# Altium schematic sheet Sch_Sensores.SchDoc: Control de Domótica
size A4; Author: Francisco González González - Eugenia Ipar; CompanyName: Control de Sensores; DocumentNumber: 5; SheetNumber: 5; SheetTotal: 12; Materia: Técnicas Digitales II; Year: 2015; Placa: Sensores; Prof1: Prof: Alarcón, Juan; Prof2: Ayud: Crivelli, Marcelo; Prof3: Ayud: Montalti, Pablo; PageSetup: Record=PageOptions|CenterHorizontal=True|CenterVertical=True|PrintScale=1.00|XCorrection=1.00|YCorrection=1.00|PrintKind=0|BorderSize=5000000|LeftOffset=0|BottomOffset=0|Orientation=2|PaperLength=1000|PaperWidth=1000|Scale=100|PaperSource=7|PrintQuality=-3|MediaType=1|DitherType=10|PrintScaleMode=1|PaperKind=A4|PaperIndex=9
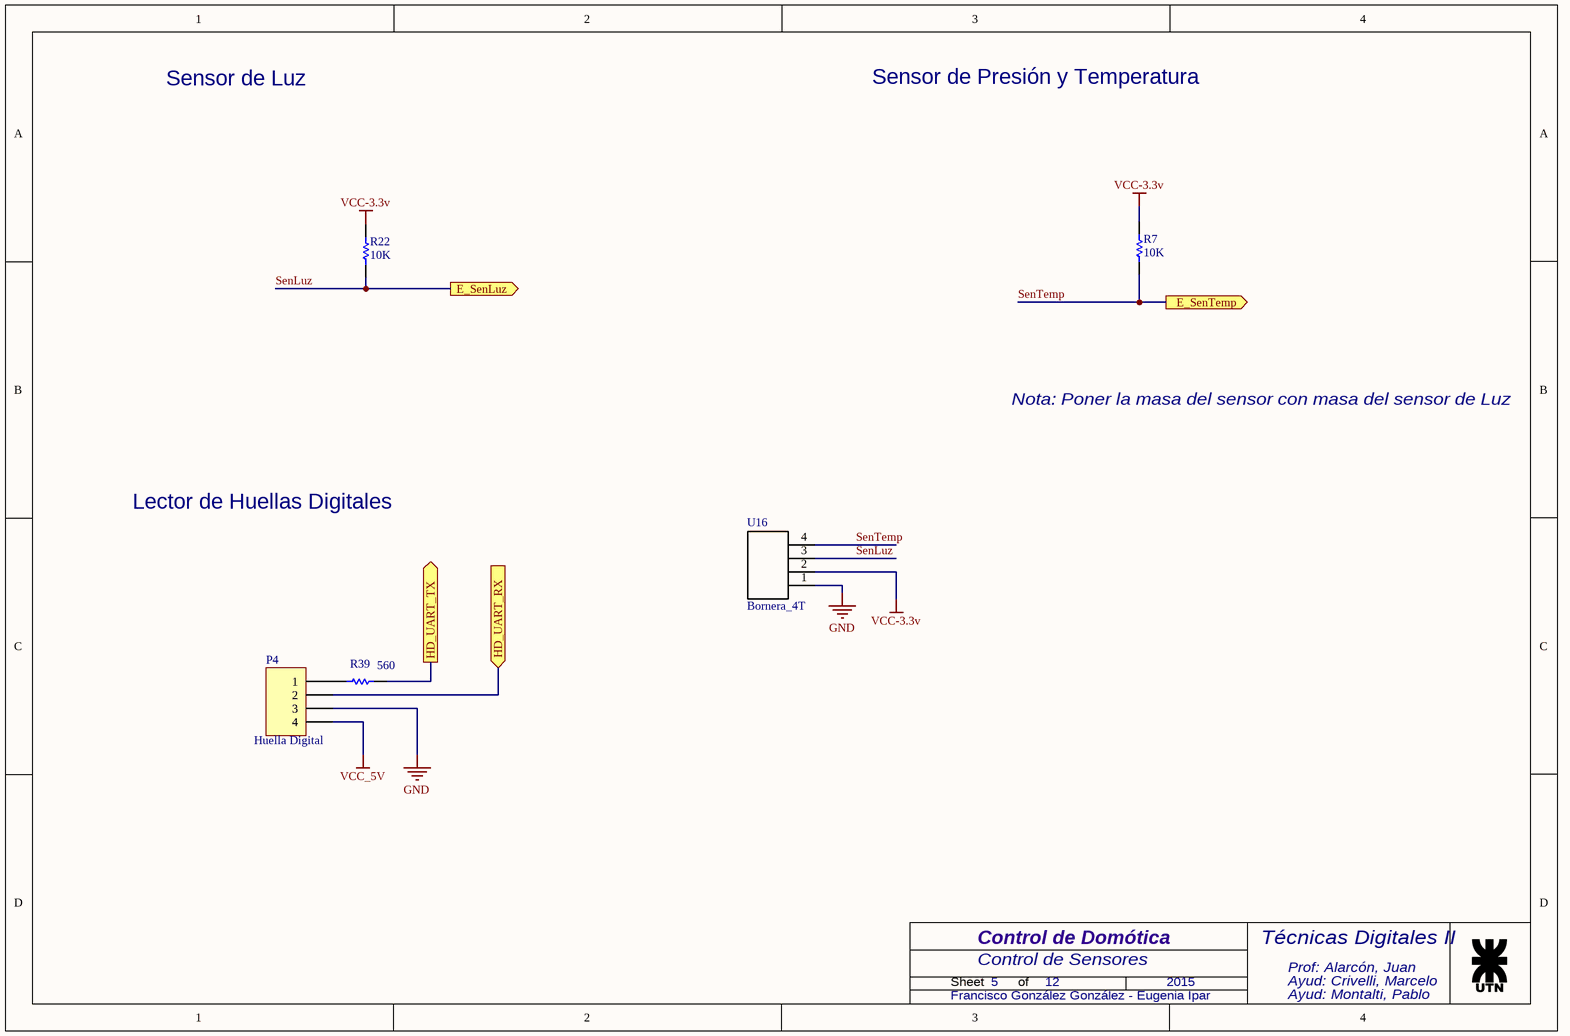
[diagram p0: Sch_Sensores.SchDoc]

## Parts
P4  Huella Digital  [HDR1X4]
R7  value 10K  [AXIAL-0.3]  (hidden comment: Res1)
R22  value 10K  [AXIAL-0.3]  (hidden comment: Res1)
R39  value 560  [AXIAL-0.3]  (hidden comment: Res1)
U16  Bornera_4T  [BORNERA_4]

## Ports
E_SenLuz (out), E_SenTemp (out), HD_UART_RX (in), HD_UART_TX (out)

## Nets
GND: P4.3 U16.1
VCC-3.3v: R7.2 R22.2 U16.2
VCC_5V: P4.4
HD_UART_RX: P4.2 ; port HD_UART_RX
HD_UART_TX: R39.1 ; port HD_UART_TX
SenLuz: R22.1 U16.3 ; port E_SenLuz
SenTemp: R7.1 U16.4 ; port E_SenTemp
NetP4_1: P4.1 R39.2

## Notes on the sheet
- Sensor de Luz
- Sensor de Presión y Temperatura
- Nota: Poner la masa del sensor con masa del sensor de Luz
- Lector de Huellas Digitales
- Sheet
- of

## Library data of the parts
P4 = Header 4: Header, 4-Pin; LatestRevisionDate: 17-Jul-2002; LatestRevisionNote: Re-released for DXP Platform.; Publisher: Altium Limited
R7 R22 R39 = Res1: Resistor; Published: 8-Jun-2000; LatestRevisionDate: 17-Jul-2002; LatestRevisionNote: Re-released for DXP Platform.; PackageReference: AXIAL-0.3; Publisher: Altium Limited; PackageDescription: Axial Device, Thru-Hole; 2 Leads; 0.3 in Pin Spacing
U16 = Bornera_4T: Bornera de 4 Terminales Pitch 5mm